# EasyEDA schematic IoT_BOS_frigo.json
TITLE: Sheet_1; REV: 1.0; Date: 2021-04-13; Sheet: 1/1; Company: Your Company
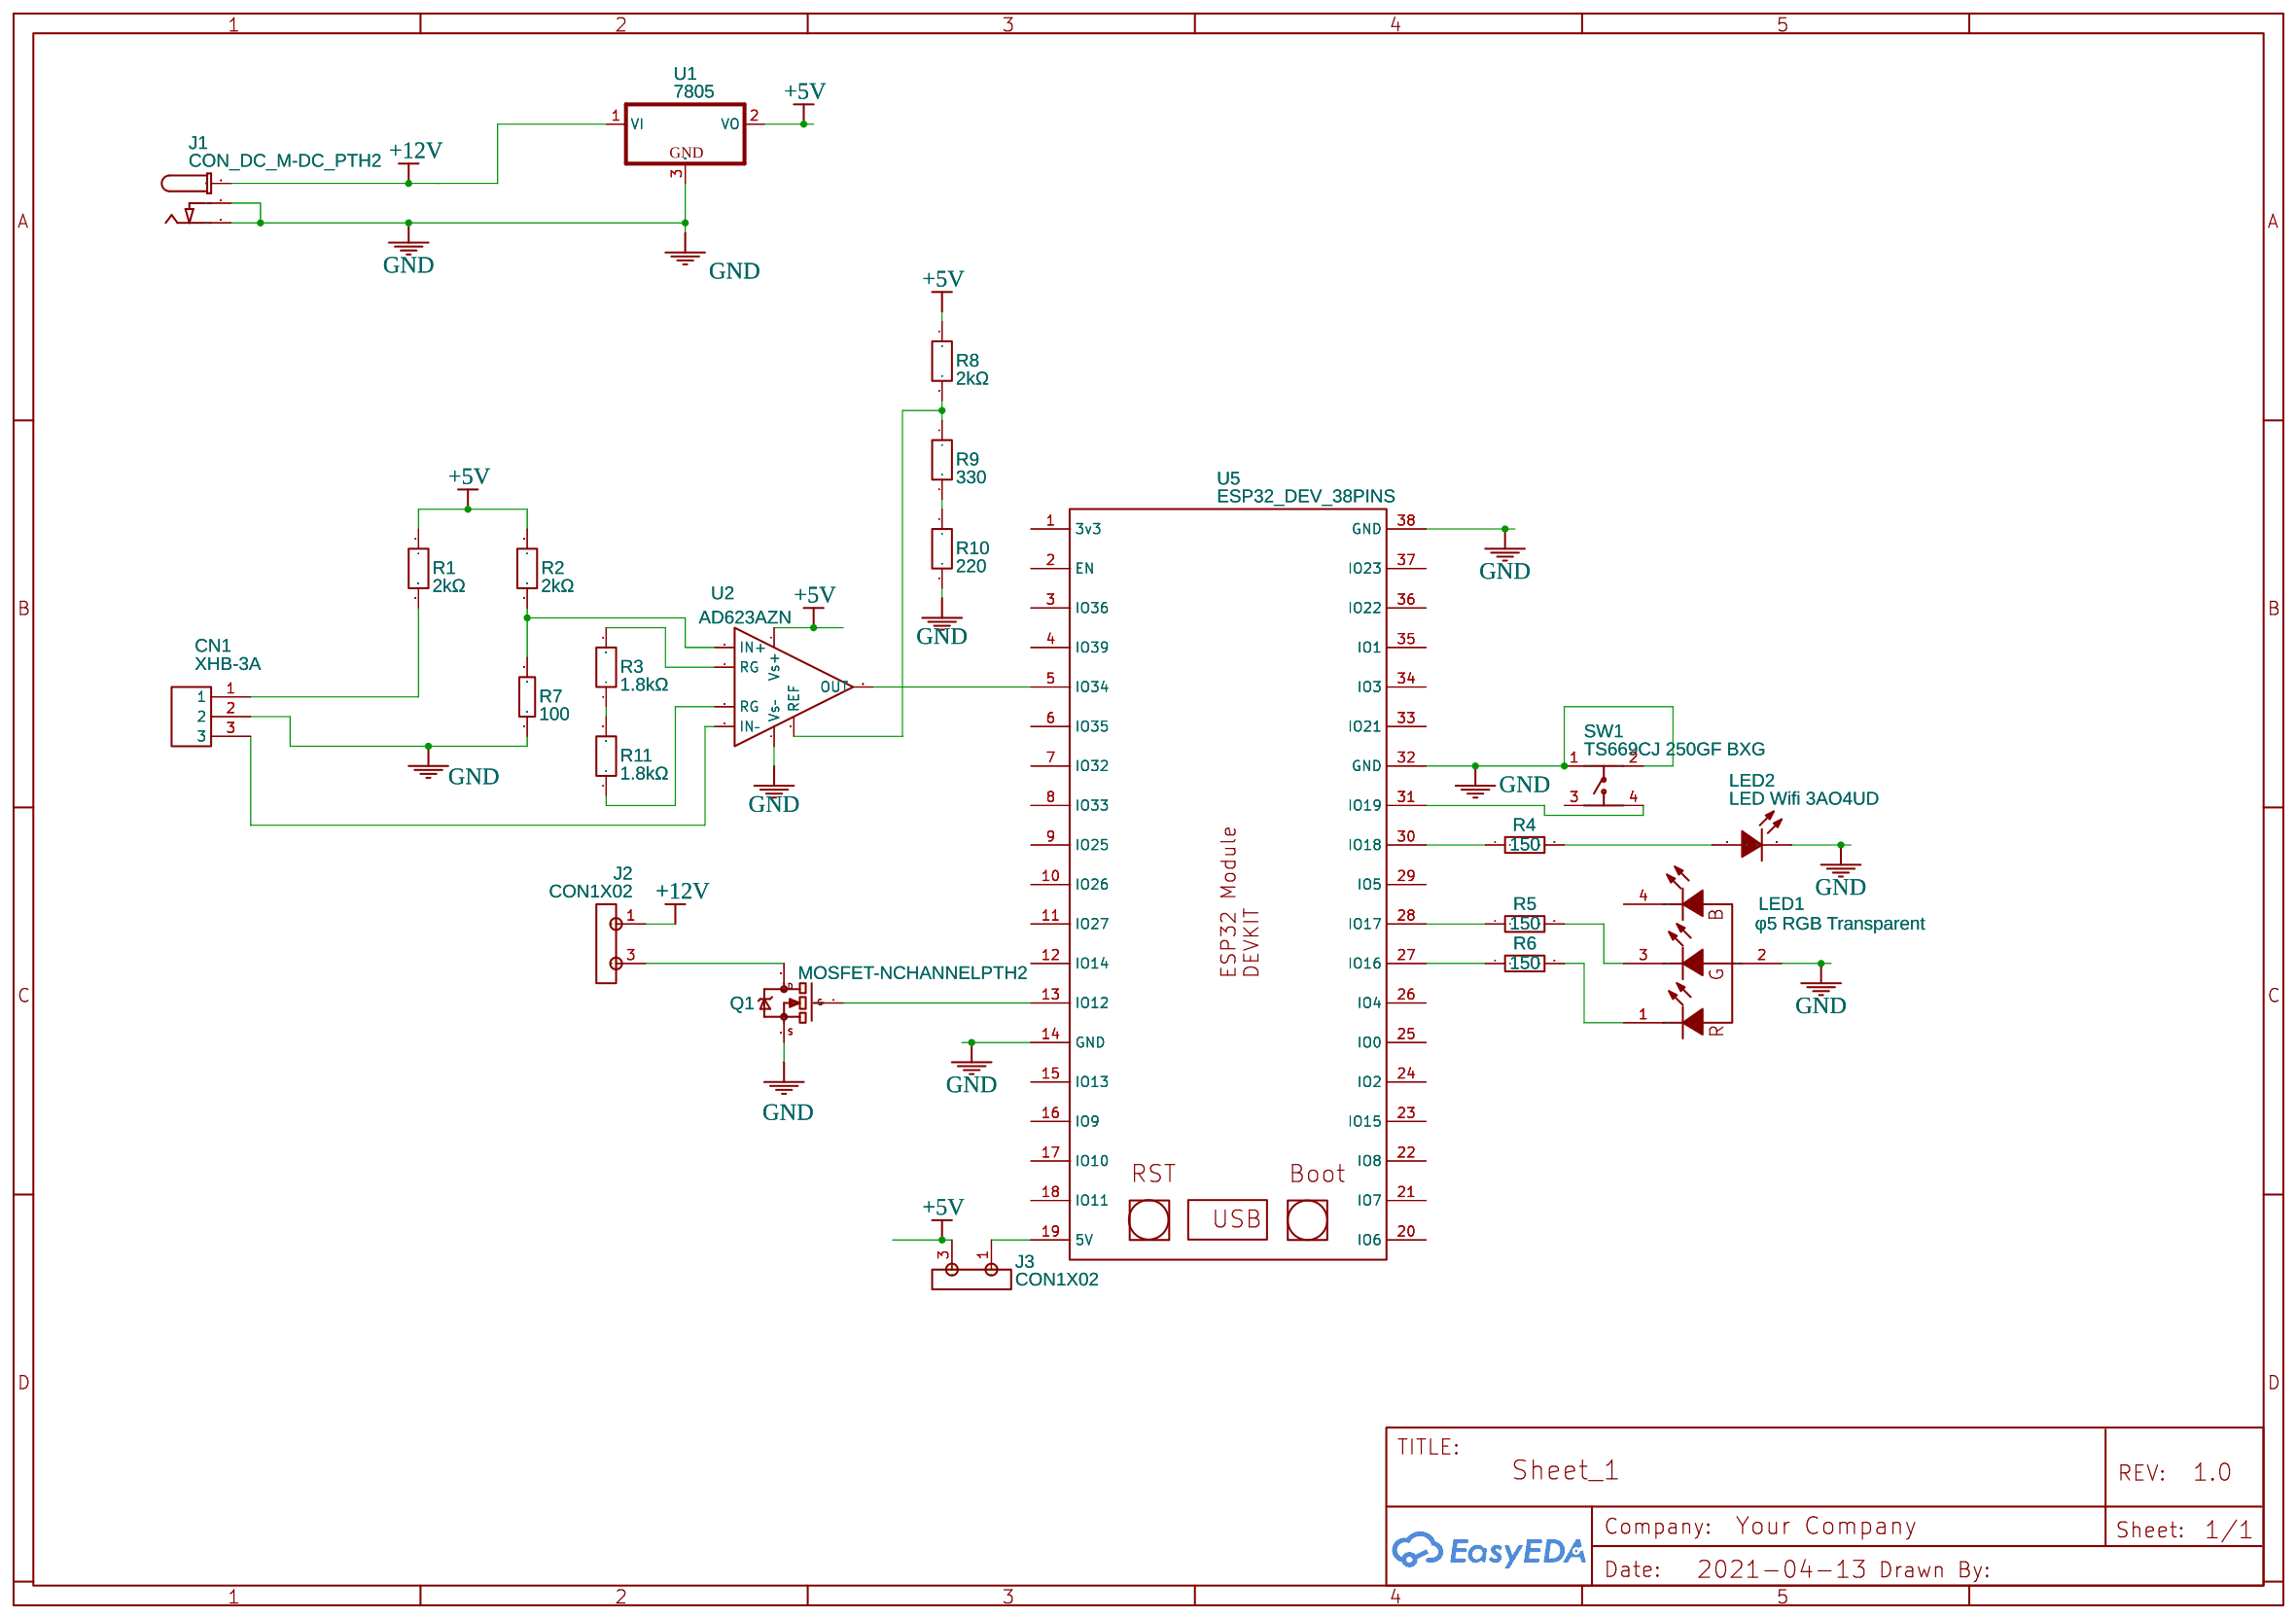
[diagram p0: schematic sheet]

## Parts
CN1  XHB-3A  [CONNECTOR3PIN]
J1  CON_DC_M-DC_PTH2  [DC_BARREL_JACK_PTH_2MM_2]
J2  CON1X02  [CONNECTOR3PIN]
J3  CON1X02  [CONNECTOR3PIN]
LED1  φ5 RGB Transparent  [LED-TH_4P-BD5.8-P1.30]
LED2  LED Wifi 3AO4UD  [RES-TH_BD5.4-P2.50-D0.4]
Q1  MOSFET-NCHANNELPTH2  [TO220VERTICAL]
R1  2kΩ  [RES-TH_BD2.5-L6.5-P10.50-D0.6]
R2  2kΩ  [RES-TH_BD2.5-L6.5-P10.50-D0.6]
R3  1.8kΩ  [RES-TH_BD2.5-L6.5-P10.50-D0.6]
R4  150  [RES-TH_BD2.5-L6.5-P10.50-D0.6]
R5  150  [RES-TH_BD2.5-L6.5-P10.50-D0.6]
R6  150  [RES-TH_BD2.5-L6.5-P10.50-D0.6]
R7  100  [RES-TH_BD2.5-L6.5-P10.50-D0.6]
R8  2kΩ  [RES-TH_BD2.5-L6.5-P10.50-D0.6]
R9  330  [RES-TH_BD2.5-L6.5-P10.50-D0.6]
R10  220  [RES-TH_BD2.5-L6.5-P10.50-D0.6]
R11  1.8kΩ  [RES-TH_BD2.5-L6.5-P10.50-D0.6]
SW1  TS669CJ 250GF BXG  [KEY-TH_4P-L6.0-W6.0-P4.50-LS6.50]
U1  7805  [TO220VERTICAL]
U2  AD623AZN  [DIP8_]
U5  ESP32_DEV_38PINS  [AZ-DELIVERY NODEMCU ESP32 DEV KIT]

## Library data of the parts
CN1 = XHB-3A: Supplier: LCSC; Manufacturer: BOOMELE; image: //image.lceda.cn/szlcsc/C68817.jpg; Supplier Part: C68817
J1 = CON_DC_M-DC_PTH2: DC power connector; Contributor: DangerousPrototype
J2 J3 = CON1X02: Contributor: KiCad
LED1 = φ5 RGB Transparent: Supplier: LCSC; Manufacturer: KENTO; Manufacturer Part: φ5 RGB Transparent LED; Contributor: LCSC; Supplier Part: C32985
LED2 = LEDOrange orange 3AO4UD: Supplier: LCSC; Manufacturer: KENTO; image: //image.lceda.cn/szlcsc/C62095.jpg; Supplier Part: C62095
Q1 = MOSFET-NCHANNELPTH2: Contributor: Pinoccio
R1 R2 R8-R10 = CF1/4W-2KΩ±5%T52: Supplier: LCSC; Supplier Part: C714305; Manufacturer: Huaxing Mechanical-Elec.; Contributor: LCSC
R3 R11 = CF1/4W-1.8KΩ±5%T52: Supplier: LCSC; Supplier Part: C714304; Manufacturer: Huaxing Mechanical-Elec.; Contributor: LCSC
R4-R6 = CFR03SJ0151AA0: Supplier: LCSC; Manufacturer: UniOhm; Supplier Part: C69877; LCSC Assembly: Yes; SMT Type: Extend; Paste Type: expand
R7 = CFR0S2J0101A10: Supplier: LCSC; Manufacturer: UniOhm; Supplier Part: C61282; LCSC Assembly: Yes; SMT Type: Extend; Paste Type: expand
SW1 = TS669CJ 250GF BXG: Supplier: LCSC; Supplier Part: C2765193; Manufacturer: SHOU HAN(首韩); Manufacturer Part: TS669CJ 250gf BXG; Contributor: LCSC
U1 = 7805: Contributor: Adafruit
U2 = AD620N: Contributor: lukasztolak
U5 = ESP32_DEV_38PINS: Manufacturer Part: ESP32 DEV KIT; Contributor: leoScript; link: https://www.espressif.com/en/products/hardware/esp32-devkitc/overview

## Nets
+5V: J3.3(2) R1.1 R2.1 R8.1 U1.2(VO) U2.7(Vs+)
+12V: J1.P1 J2.1 U1.1(VI)
GND: CN1.2 J1.P2(P3) J1.P3(P2) LED1.2(CA) LED2.2(K) Q1.2(S) R7.1 R10.2 SW1.1 SW1.2 U1.3(GND) U2.4(Vs–) U5.14(GND) U5.32(GND) U5.38(GND)
Net-(CN1-1): CN1.1 R1.2
Net-(CN1-3): CN1.3 U2.2(IN–)
Net-(J2-3): J2.3(2) Q1.3(D)
Net-(J3-1): J3.1 U5.19(5V)
Net-(LED1-1): LED1.1(KR) R6.2
Net-(LED1-3): LED1.3(KG) R5.2
Net-(LED2-1): LED2.1(A) R4.2
Net-(Q1-1): Q1.1(G) U5.13(IO12)
Net-(R2-2): R2.2 R7.2 U2.3(IN+)
Net-(R3-1): R3.1 R11.2
Net-(R3-2): R3.2 U2.1(RG)
Net-(R4-1): R4.1 U5.30(IO18)
Net-(R5-1): R5.1 U5.28(IO17)
Net-(R6-1): R6.1 U5.27(IO16)
Net-(R8-2): R8.2 R9.1 U2.5(REF)
Net-(R9-2): R9.2 R10.1
Net-(R11-1): R11.1 U2.8(RG)
Net-(SW1-4): SW1.4 U5.31(IO19)
Net-(U2-6): U2.6(OUT) U5.5(IO34)

Not connected (* = marked no-connect by the designer): LED1 4(KB); SW1 3; U5 1(3v3) 2(EN) 3(IO36) 4(IO39) 6(IO35) 7(IO32) 8(IO33) 9(IO25) 10(IO26) 11(IO27) 12(IO14) 15(IO13) 16(IO9) 17(IO10) 18(IO11) 20(IO6) 21(IO7) 22(IO8) 23(IO15) 24(IO2) 25(IO0) 26(IO4) 29(IO5) 33(IO21) 34(IO3) 35(IO1) 36(IO22) 37(IO23)
